# EAGLE design tinyduino-breakout-mk-4.0 (EAGLE 7.5.0)
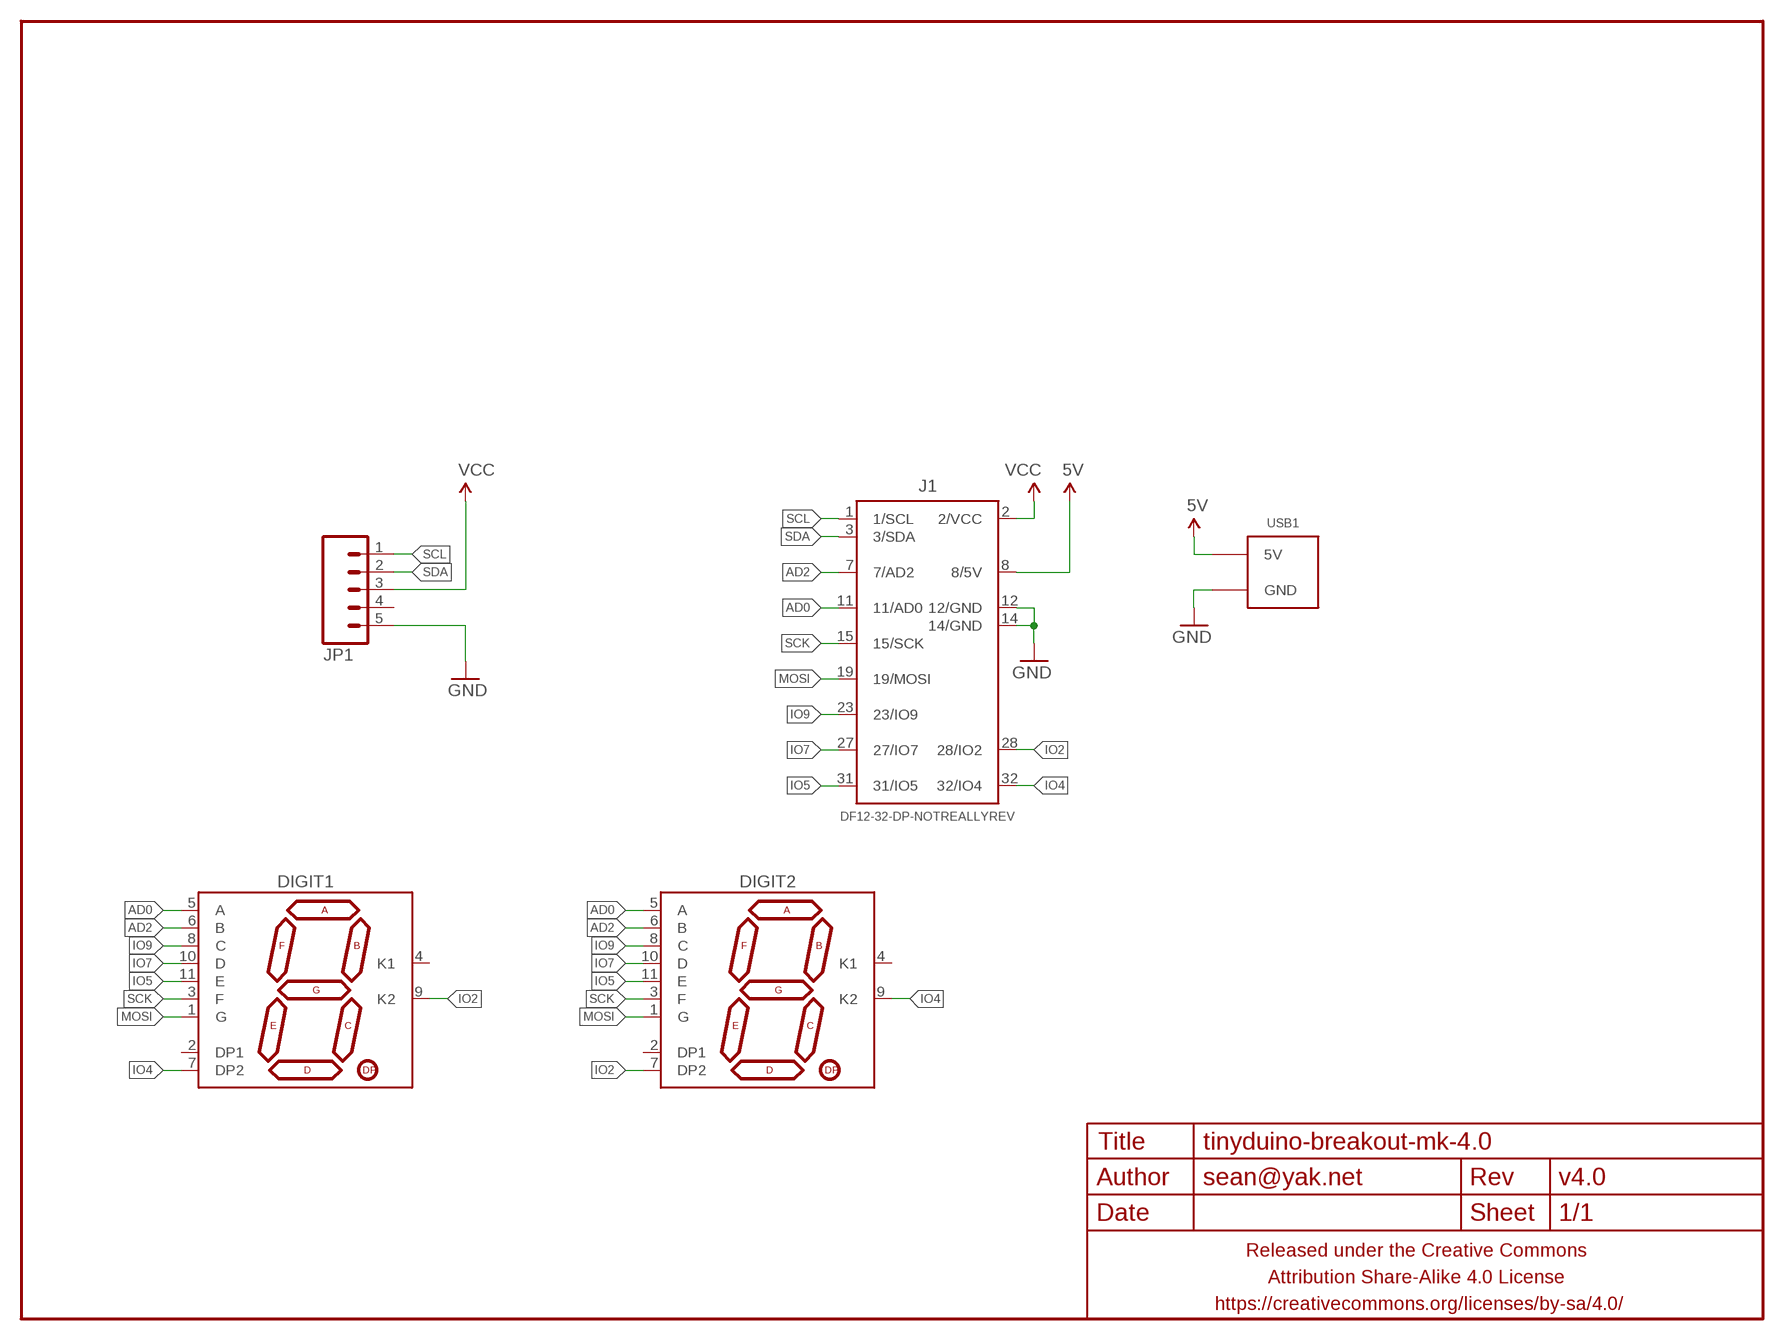
[diagram p0: schematic, sheet 1]

## Parts
DIGIT1  7SEG_1DIG_2DP7MM_CC_SMT  [7SEG_1DIG_7MM_SMT]
DIGIT2  7SEG_1DIG_2DP7MM_CC_SMT  [7SEG_1DIG_7MM_SMT]
FRAME1  FRAME-LETTERNO_PACKAGE  [DUMMY]
J1  DF12-32-DP-NOTREALLYREV  [DF12-32-DP-I2C+EXTRA-REV]
JP1  M05PTH-CENTERED  [1X05_PTH_CENTERED]
USB1  USB_AB_PWRONLY  [FCI-10103594-USB-MICRO-B-PWRONLY]

## Nets
5V: J1.8(8/5V) USB1.1(5V)
AD0: DIGIT1.5(A) DIGIT2.5(A) J1.11(11/AD0)
AD2: DIGIT1.6(B) DIGIT2.6(B) J1.7(7/AD2)
GND: J1.12(12/GND) J1.14(14/GND) JP1.5 USB1.5(GND) USB1.SHIELD@1(GND) USB1.SHIELD@2(GND) USB1.SHIELD@3(GND) USB1.SHIELD@4(GND)
IO2: DIGIT1.9(K2) DIGIT2.7(DP2) J1.28(28/IO2)
IO4: DIGIT1.7(DP2) DIGIT2.9(K2) J1.32(32/IO4)
IO5: DIGIT1.11(E) DIGIT2.11(E) J1.31(31/IO5)
IO7: DIGIT1.10(D) DIGIT2.10(D) J1.27(27/IO7)
IO9: DIGIT1.8(C) DIGIT2.8(C) J1.23(23/IO9)
MOSI: DIGIT1.1(G) DIGIT2.1(G) J1.19(19/MOSI)
SCK: DIGIT1.3(F) DIGIT2.3(F) J1.15(15/SCK)
SCL: J1.1(1/SCL) JP1.1
SDA: J1.3(3/SDA) JP1.2
VCC: J1.2(2/VCC) JP1.3
Unconnected: DIGIT1.2(DP1) DIGIT1.4(K1) DIGIT2.2(DP1) DIGIT2.4(K1) JP1.4

## Library data of the parts
DIGIT1 DIGIT2 = a_parts:7SEG_1DIG_2DP
FRAME1 = A_butts:FRAME-LETTER: Schematic Frame Standard 8.5x11 US Letter frame; DESIGNER: sean@yak.net; VERSION: v4.0
J1 = a_parts:DF12-32-DP-NOTREALLY
JP1 = a_parts:M05: Header 5 Standard 5-pin 0.1" header. Use with straight break away headers (SKU : PRT-00116), right angle break away headers (PRT-00553), swiss pins (PRT-00743), machine pins (PRT-00117), and female headers (PRT-00115). Molex polarized connector foot print use with SKU : PRT-08230 with associated crimp pins and housings.
USB1 = a_parts:USB_AB_PWRONLY

## Board
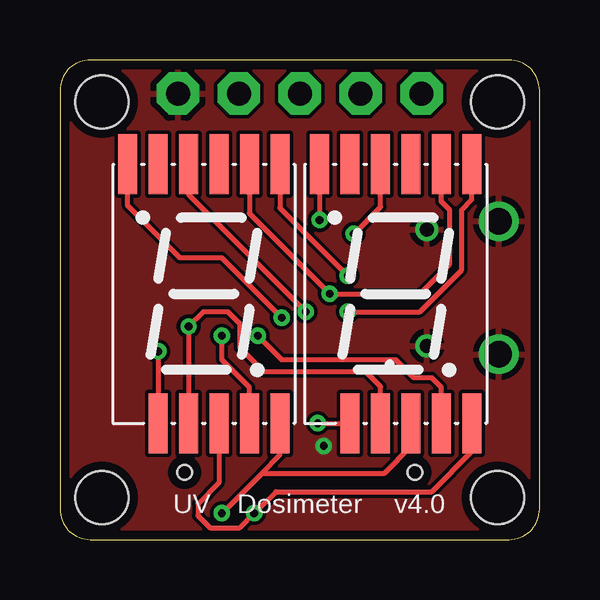
[diagram p1: board, top side]
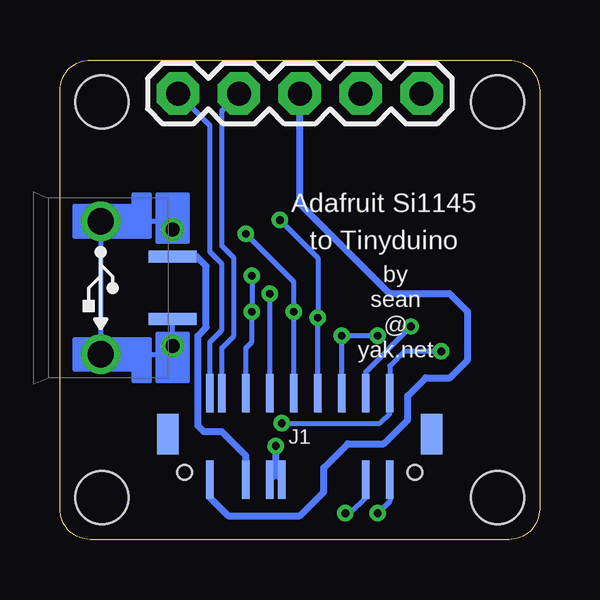
[diagram p2: board, bottom side, seen from below]

Size 20 x 20 mm. Coordinates in mm from the lower left corner, seen from the top.
Outline: 0,18.73 0,1.27 arc90 1.27,0 18.73,0 arc90 20,1.27 20,18.73 arc90 18.73,20 1.27,20 arc90 0,18.73
Copper layers (1*16): Top 0.0356mm / dielectric 1.5011mm / Bottom 0.0356mm
Design rules "LaenPCBOrder_2": minimum track width 6mil, minimum drill 13mil, track to track 6mil, track to pad 6mil, pad to pad 6mil, via to via 6mil, smd to smd 6mil, copper to edge 15mil, drill to drill 6mil, minimum pad ring 7mil, minimum via ring 7mil, stop-mask expansion 3mil, vias tented up to drill 20mil, thermal gap 10mil
Holes 2.2 mm at 1.75,1.75 18.25,1.75 1.75,18.25 18.25,18.25

### Footprints (pad centres in the part's own frame; a part is rotated, then mirrored left to right if it is on the bottom)
7SEG_1DIG_7MM_SMT = smd 0.8 x 2.5: 1 -3.175,5.4; 2 -1.905,5.4; 3 -0.635,5.4; 4 0.635,5.4; 5 1.905,5.4; 6 3.175,5.4; 7 3.175,-5.4; 8 1.905,-5.4; 9 0.635,-5.4; 10 -0.635,-5.4; 11 -1.905,-5.4
DF12-32-DP-I2C+EXTRA-REV = smd 0.3 x 1.6 bottom: 1 -3.75,-1.8; 2 -3.75,1.8; 3 -3.25,-1.8; 7 -2.25,-1.8; 8 -2.25,1.8; 11 -1.25,-1.8; 12 -1.25,1.8; 14 -0.75,1.8; 15 -0.25,-1.8; 19 0.75,-1.8; 23 1.75,-1.8; 27 2.75,-1.8; 28 2.75,1.8; 31 3.75,-1.8; 32 3.75,1.8 | smd 0.9 x 1.7 bottom: F1 -5.5,-0.1; F2 5.5,-0.1 | hole 0.6: -4.8,1.5; 4.8,1.5
1X05_PTH_CENTERED = drill 1 pad 1.778 octagon: 1 -5.08,0; 2 -2.54,0; 3 0,0; 4 2.54,0; 5 5.08,0
FCI-10103594-USB-MICRO-B-PWRONLY = smd 0.5 x 2: 1 -1.3,3; 5 1.3,3 | drill 0.6: SHIELD@1 -2.425,3; SHIELD@2 2.425,3 | drill 1.1 pad 1.3: SHIELD@3 -2.775,0; SHIELD@4 2.775,0

### Placement (x,y rotation side)
DIGIT1  6,10.25 0 top
DIGIT2  14,10.25 0 top
FRAME1  0,0 0 top
J1  10,4.3 180 top
JP1  10,18.6 0 bottom
USB1  18.3,10.5 270 bottom

### Tracks (layer width: path | path; a pad name or v marks a point on that pad's centre or on a via)
5V
  Bottom 0.3: J1.8 12.25,3.5 13.25,4.5 14,4.5 14.25,4.75 14.25,8.5 13.9,8.85 13.9,11.4 14.3,11.8 USB1.1
AD0  (via drill 0.33)
  Top 0.2: DIGIT2.5 15.9,14.1 16.25,13.75 16.25,11.5 15,10.25 v11.25,10.25 7.91,13.6 DIGIT1.5
  Bottom 0.2: J1.11 v11.25,10.25
AD2  (via drill 0.33)
  Top 0.2: v12,9.5 15,9.5 16.75,11.25 16.75,13.75 17.18,14.18 DIGIT2.6 | DIGIT1.6 9.18,13.82 v12,11
  Bottom 0.2: J1.7 12.25,8 12,8.25 v12,9.5 v12,11
GND  (via drill 0.33)
  Bottom 0.2: USB1.5 USB1.SHIELD@2 15.65,7.72 USB1.SHIELD@4 USB1.SHIELD@3 15.65,13.28 USB1.SHIELD@1
  Bottom 0.3: J1.14 11,2.75 | 11,2.75 v11,3.9 | J1.12 11,2.75
  pour Top: 0,0 0,20 20,20 20,0
IO2  (via drill 0.33)
  Top 0.2: DIGIT2.7 17.18,3.67 15.5,2 9,2 v8.1,1.1 7.5,0.5 6.25,0.5 5.75,1 5.75,1.5 6.63,2.38 DIGIT1.9
  Bottom 0.2: J1.28 7.25,1.75 7.9,1.1 v8.1,1.1
IO4  (via drill 0.33)
  Top 0.2: DIGIT2.9 14.63,3.88 13.5,2.75 8.4,2.75 | v6.75,1.1 8.4,2.75 | 8.4,2.75 9.18,3.52 DIGIT1.7
  Bottom 0.2: J1.32 6.25,1.6 v6.75,1.1
IO5  (via drill 0.33)
  Top 0.2: v4.09,7.84 DIGIT1.11 | v10.75,4.85 DIGIT2.11
  Bottom 0.2: v4.09,7.84 5.66,7.84 6.25,7.25 J1.31 6.25,5.25 6.65,4.85 v10.75,4.85
IO7  (via drill 0.33)
  Top 0.2: DIGIT2.10 13.37,6.38 12.75,7 8.5,7 7.5,8 7.5,9 7,9.5 5.98,9.5 v5.37,8.88 DIGIT1.10
  Bottom 0.2: J1.27 7.25,7 v5.37,8.88
IO9  (via drill 0.33)
  Top 0.2: DIGIT2.8 15.9,6.34 15.5,6.75 14.75,6.75 14,7.5 9.25,7.5 v8.25,8.5 | DIGIT1.8 7.91,6.34 6.75,7.5 v6.75,8.5
  Bottom 0.2: J1.23 v8.25,8.5 v6.75,8.5
MOSI  (via drill 0.33)
  Top 0.2: v9.25,9.25 6.75,11.75 5,11.75 2.83,13.93 DIGIT1.1 | DIGIT2.1 v10.82,13.32
  Bottom 0.2: J1.19 v9.25,9.25 9.25,11.75 v10.82,13.32
SCK  (via drill 0.33)
  Top 0.2: v12.25,12.75 13.37,13.87 DIGIT2.3 | DIGIT1.3 5.37,14.38 v10.25,9.5
  Bottom 0.2: J1.15 v10.25,9.5 10.25,10.75 v12.25,12.75
SCL
  Bottom 0.2: J1.1 13.75,8.25 13.25,8.75 13.25,11.5 13.75,12 13.75,17.27 JP1.1
SDA
  Bottom 0.2: J1.3 13.25,8 12.75,8.5 12.75,11.75 13.25,12.25 13.25,17.89 JP1.2
VCC
  Bottom 0.3: J1.2 13.75,1.75 13,1 10,1 9,2 9,3 8,4 6.5,4 5.5,5 5.5,6 4.75,6.75 3.75,6.75 3,7.5 3,9.5 3.75,10.25 6.25,10.25 10,14 JP1.3

### Text on the board
tPlace: UV | Dosimeter
bPlace: Adafruit Si1145 | to Tinyduino | by / sean / @ / yak.net